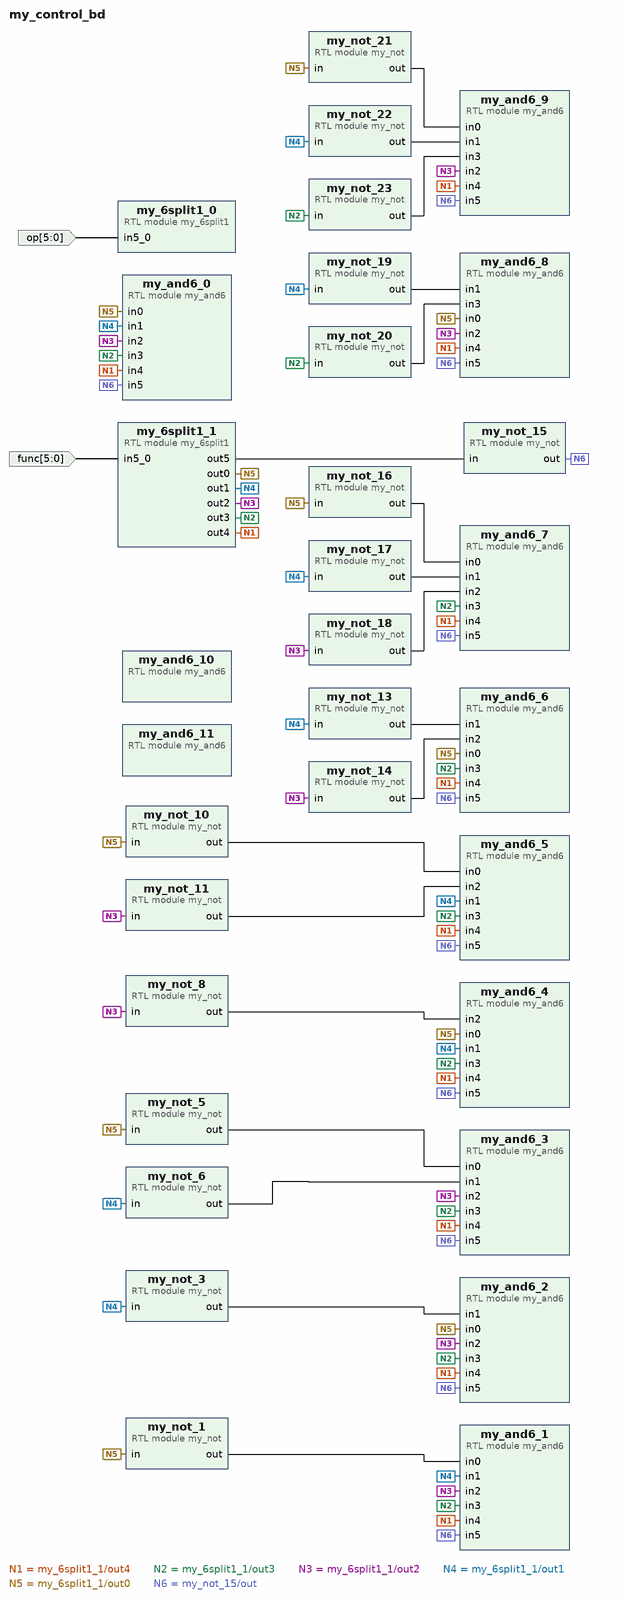
[diagram p0: block diagram of the top level]
# Vivado block design my_control_bd, Vivado 2016.2
create_bd_design my_control_bd

create_bd_port -dir I -from 5 -to 0 op
create_bd_port -dir I -from 5 -to 0 func

create_bd_cell -type module -reference my_6split1 my_6split1_0
create_bd_cell -type module -reference my_not my_not_1
create_bd_cell -type module -reference my_and6 my_and6_0
create_bd_cell -type module -reference my_and6 my_and6_2
create_bd_cell -type module -reference my_not my_not_3
create_bd_cell -type module -reference my_6split1 my_6split1_1
create_bd_cell -type module -reference my_and6 my_and6_1
create_bd_cell -type module -reference my_and6 my_and6_11
create_bd_cell -type module -reference my_and6 my_and6_3
create_bd_cell -type module -reference my_and6 my_and6_4
create_bd_cell -type module -reference my_and6 my_and6_5
create_bd_cell -type module -reference my_and6 my_and6_6
create_bd_cell -type module -reference my_and6 my_and6_7
create_bd_cell -type module -reference my_and6 my_and6_8
create_bd_cell -type module -reference my_and6 my_and6_9
create_bd_cell -type module -reference my_not my_not_11
create_bd_cell -type module -reference my_not my_not_13
create_bd_cell -type module -reference my_not my_not_14
create_bd_cell -type module -reference my_not my_not_15
create_bd_cell -type module -reference my_not my_not_16
create_bd_cell -type module -reference my_not my_not_17
create_bd_cell -type module -reference my_not my_not_18
create_bd_cell -type module -reference my_not my_not_19
create_bd_cell -type module -reference my_not my_not_5
create_bd_cell -type module -reference my_not my_not_6
create_bd_cell -type module -reference my_not my_not_8
create_bd_cell -type module -reference my_not my_not_10
create_bd_cell -type module -reference my_and6 my_and6_10
create_bd_cell -type module -reference my_not my_not_20
create_bd_cell -type module -reference my_not my_not_21
create_bd_cell -type module -reference my_not my_not_22
create_bd_cell -type module -reference my_not my_not_23

# ---- connections ----

connect_bd_net [get_bd_ports op] [get_bd_pins my_6split1_0/in5_0]
connect_bd_net [get_bd_ports func] [get_bd_pins my_6split1_1/in5_0]
connect_bd_net [get_bd_pins my_6split1_1/out4] \
  [get_bd_pins my_and6_0/in4] [get_bd_pins my_and6_2/in4] [get_bd_pins my_and6_1/in4] [get_bd_pins my_and6_3/in4] \
  [get_bd_pins my_and6_4/in4] [get_bd_pins my_and6_5/in4] [get_bd_pins my_and6_6/in4] [get_bd_pins my_and6_7/in4] \
  [get_bd_pins my_and6_8/in4] [get_bd_pins my_and6_9/in4]
connect_bd_net [get_bd_pins my_6split1_1/out3] \
  [get_bd_pins my_and6_0/in3] [get_bd_pins my_and6_2/in3] [get_bd_pins my_and6_1/in3] [get_bd_pins my_and6_3/in3] \
  [get_bd_pins my_and6_4/in3] [get_bd_pins my_and6_5/in3] [get_bd_pins my_and6_6/in3] [get_bd_pins my_and6_7/in3] \
  [get_bd_pins my_not_20/in] [get_bd_pins my_not_23/in]
connect_bd_net [get_bd_pins my_6split1_1/out2] \
  [get_bd_pins my_and6_0/in2] [get_bd_pins my_and6_2/in2] [get_bd_pins my_and6_1/in2] [get_bd_pins my_and6_3/in2] \
  [get_bd_pins my_and6_8/in2] [get_bd_pins my_and6_9/in2] [get_bd_pins my_not_11/in] [get_bd_pins my_not_14/in] \
  [get_bd_pins my_not_18/in] [get_bd_pins my_not_8/in]
connect_bd_net [get_bd_pins my_6split1_1/out1] \
  [get_bd_pins my_and6_0/in1] [get_bd_pins my_not_3/in] [get_bd_pins my_and6_1/in1] [get_bd_pins my_and6_4/in1] \
  [get_bd_pins my_and6_5/in1] [get_bd_pins my_not_13/in] [get_bd_pins my_not_17/in] [get_bd_pins my_not_19/in] \
  [get_bd_pins my_not_6/in] [get_bd_pins my_not_22/in]
connect_bd_net [get_bd_pins my_6split1_1/out0] \
  [get_bd_pins my_not_1/in] [get_bd_pins my_and6_0/in0] [get_bd_pins my_and6_2/in0] [get_bd_pins my_and6_4/in0] \
  [get_bd_pins my_and6_6/in0] [get_bd_pins my_and6_8/in0] [get_bd_pins my_not_16/in] [get_bd_pins my_not_5/in] \
  [get_bd_pins my_not_10/in] [get_bd_pins my_not_21/in]
connect_bd_net [get_bd_pins my_not_1/out] [get_bd_pins my_and6_1/in0]
connect_bd_net [get_bd_pins my_not_3/out] [get_bd_pins my_and6_2/in1]
connect_bd_net [get_bd_pins my_not_5/out] [get_bd_pins my_and6_3/in0]
connect_bd_net [get_bd_pins my_not_6/out] [get_bd_pins my_and6_3/in1]
connect_bd_net [get_bd_pins my_not_8/out] [get_bd_pins my_and6_4/in2]
connect_bd_net [get_bd_pins my_not_10/out] [get_bd_pins my_and6_5/in0]
connect_bd_net [get_bd_pins my_not_11/out] [get_bd_pins my_and6_5/in2]
connect_bd_net [get_bd_pins my_not_13/out] [get_bd_pins my_and6_6/in1]
connect_bd_net [get_bd_pins my_not_14/out] [get_bd_pins my_and6_6/in2]
connect_bd_net [get_bd_pins my_6split1_1/out5] [get_bd_pins my_not_15/in]
connect_bd_net [get_bd_pins my_not_15/out] \
  [get_bd_pins my_and6_2/in5] [get_bd_pins my_and6_0/in5] [get_bd_pins my_and6_1/in5] [get_bd_pins my_and6_3/in5] \
  [get_bd_pins my_and6_4/in5] [get_bd_pins my_and6_5/in5] [get_bd_pins my_and6_6/in5] [get_bd_pins my_and6_7/in5] \
  [get_bd_pins my_and6_8/in5] [get_bd_pins my_and6_9/in5]
connect_bd_net [get_bd_pins my_not_16/out] [get_bd_pins my_and6_7/in0]
connect_bd_net [get_bd_pins my_not_17/out] [get_bd_pins my_and6_7/in1]
connect_bd_net [get_bd_pins my_not_18/out] [get_bd_pins my_and6_7/in2]
connect_bd_net [get_bd_pins my_not_19/out] [get_bd_pins my_and6_8/in1]
connect_bd_net [get_bd_pins my_not_20/out] [get_bd_pins my_and6_8/in3]
connect_bd_net [get_bd_pins my_not_21/out] [get_bd_pins my_and6_9/in0]
connect_bd_net [get_bd_pins my_not_22/out] [get_bd_pins my_and6_9/in1]
connect_bd_net [get_bd_pins my_not_23/out] [get_bd_pins my_and6_9/in3]

validate_bd_design
save_bd_design
